# Altium schematic sheet MainBoard_V100_AFE.SchDoc
size A4; SheetNumber: 10; SheetTotal: 22; Title_: Analog Front End
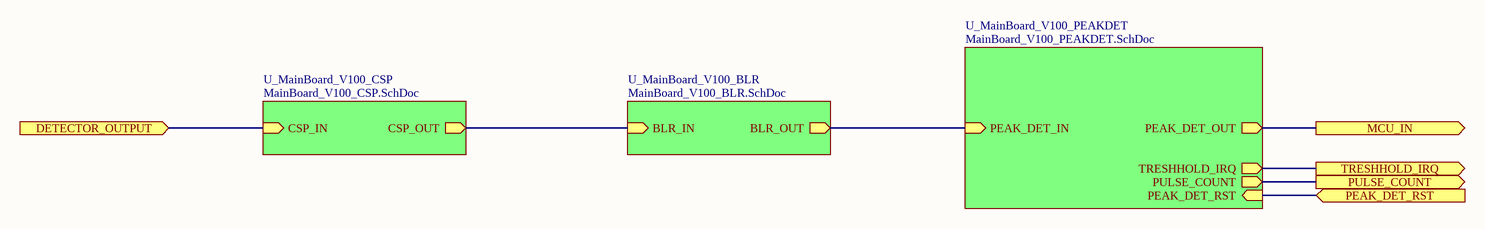
[diagram p0: MainBoard_V100_AFE.SchDoc]

## Sub-sheets
U_MainBoard_V100_BLR = MainBoard_V100_BLR.SchDoc: BLR_IN (in), BLR_OUT (out)
U_MainBoard_V100_CSP = MainBoard_V100_CSP.SchDoc: CSP_OUT (out), CSP_IN (in)
U_MainBoard_V100_PEAKDET = MainBoard_V100_PEAKDET.SchDoc: PEAK_DET_RST (in), PEAK_DET_OUT (out), TRESHHOLD_IRQ (out), PULSE_COUNT (out), PEAK_DET_IN (in)

## Ports
DETECTOR_OUTPUT (in), MCU_IN (out), PEAK_DET_RST (in), PULSE_COUNT (out), TRESHHOLD_IRQ (out)

## Nets
DETECTOR_OUTPUT: port DETECTOR_OUTPUT, sheet U_MainBoard_V100_CSP/CSP_IN
MCU_IN: port MCU_IN, sheet U_MainBoard_V100_PEAKDET/PEAK_DET_OUT
PEAK_DET_RST: port PEAK_DET_RST, sheet U_MainBoard_V100_PEAKDET/PEAK_DET_RST
PULSE_COUNT: port PULSE_COUNT, sheet U_MainBoard_V100_PEAKDET/PULSE_COUNT
TRESHHOLD_IRQ: port TRESHHOLD_IRQ, sheet U_MainBoard_V100_PEAKDET/TRESHHOLD_IRQ
(unnamed): sheet U_MainBoard_V100_BLR/BLR_IN, sheet U_MainBoard_V100_CSP/CSP_OUT
(unnamed): sheet U_MainBoard_V100_BLR/BLR_OUT, sheet U_MainBoard_V100_PEAKDET/PEAK_DET_IN

## Notes on the sheet
- Board:
- Author:
- Title:
- Project:
- SVN:
- Version:
- Sheet:
- of
- Contact:
- Modified:
- Size:
- A4